# EAGLE design opto-endstop (EAGLE 5.06)
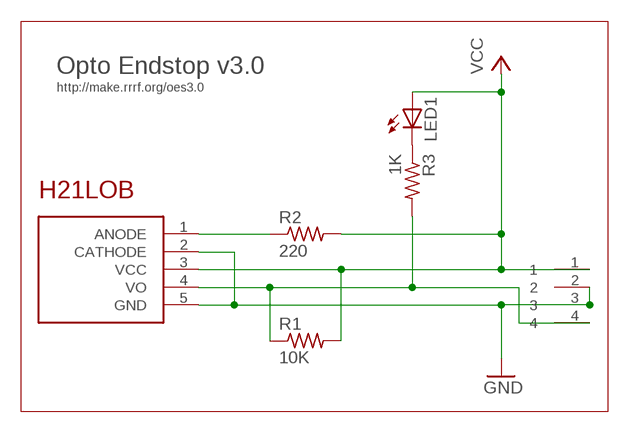
[diagram p0: schematic, sheet 1]

## Parts
LED1  LEDCHIPLED_1206  [CHIPLED_1206]
R1  10K  R-US_R1206  [R1206]
R2  220  R-US_R1206  [R1206]
R3  1K  R-US_R1206  [R1206]
U$1  H21LOB  [H21]
U$2  CDROM  [70553-04]

## Nets
GND: U$1.2(CATHODE) U$1.5(GND) U$2.2 U$2.3
N$1: LED1.C R3.1
N$2: R1.1 R3.2 U$1.4(VO) U$2.4
N$4: R2.1 U$1.1(ANODE)
VCC: LED1.A R1.2 R2.2 U$1.3(VCC) U$2.1

## Notes on the sheet
- Opto Endstop v3.0
- http://make.rrrf.org/oes3.0

## Library data of the parts
LED1 = led:LED: LED OSRAM: - CHIPLED LG R971, LG N971, LY N971, LG Q971, LY Q971, LO R971, LY R971 LH N974, LH R974 LS Q976, LO Q976, LY Q976 LO Q996 - Hyper CHIPLED LW Q18S LB Q993, LB Q99A, LB R99A - SideLED LS A670, LO A670, LY A670, LG A670, LP A670 LB A673, LV A673, LT A673, LW A673 LH A674 LY A675 LS A676, LA A676, LO A676, LY A676, LW A676 LS A679, LY A679, LG A679 - Hyper Micro SIDELED® LS Y876, LA Y876, LO Y876, LY Y876 LT Y87S - SmartLED LW L88C, LW L88S LB L89C, LB L89S, LG L890 LS L89K, LO L89K, LY L89K LS L896, LA L896, LO L896, LY L896 - TOPLED LS T670, LO T670, LY T670, LG T670, LP T670 LSG T670, LSP T670, LSY T670, LOP T670, LYG T670 LG T671, LOG T671, LSG T671 LB T673, LV T673, LT T673, LW T673 LH T674 LS T676, LA T676, LO T676, LY T676, LB T676, LH T676, LSB T676, LW T676 LB T67C, LV T67C, LT T67C, LS T67K, LO T67K, LY T67K, LW E67C LS E67B, LA E67B, LO E67B, LY E67B, LB E67C, LV E67C, LT E67C LW T67C LS T679, LY T679, LG T679 LS T770, LO T770, LY T770, LG T770, LP T770 LB T773, LV T773, LT T773, LW T773 LH T774 LS E675, LA E675, LY E675, LS T675 LS T776, LA T776, LO T776, LY T776, LB T776 LHGB T686 LT T68C, LB T68C - Hyper Mini TOPLED® LB M676 - Mini TOPLED Santana® LG M470 LS M47K, LO M47K, LY M47K Source: http://www.osram.convergy.de - LUMILED® LXK2-PW12-R00, LXK2-PW12-S00, LXK2-PW14-U00, LXK2-PW14-V00 LXK2-PM12-R00, LXK2-PM12-S00, LXK2-PM14-U00 LXK2-PE12-Q00, LXK2-PE12-R00, LXK2-PE12-S00, LXK2-PE14-T00, LXK2-PE14-U00 LXK2-PB12-K00, LXK2-PB12-L00, LXK2-PB12-M00, LXK2-PB14-N00, LXK2-PB14-P00, LXK2-PB14-Q00 LXK2-PR12-L00, LXK2-PR12-M00, LXK2-PR14-Q00, LXK2-PR14-R00 LXK2-PD12-Q00, LXK2-PD12-R00, LXK2-PD12-S00 LXK2-PH12-R00, LXK2-PH12-S00 LXK2-PL12-P00, LXK2-PL12-Q00, LXK2-PL12-R00 Source: www.luxeon.com
R1-R3 = resistor:R-US_: RESISTOR, American symbol
U$1 = reprap:H21LOB
U$2 = reprap:CDROM

## Net classes
0 default: width 0.406 mm, clearance 0.406 mm

## Board
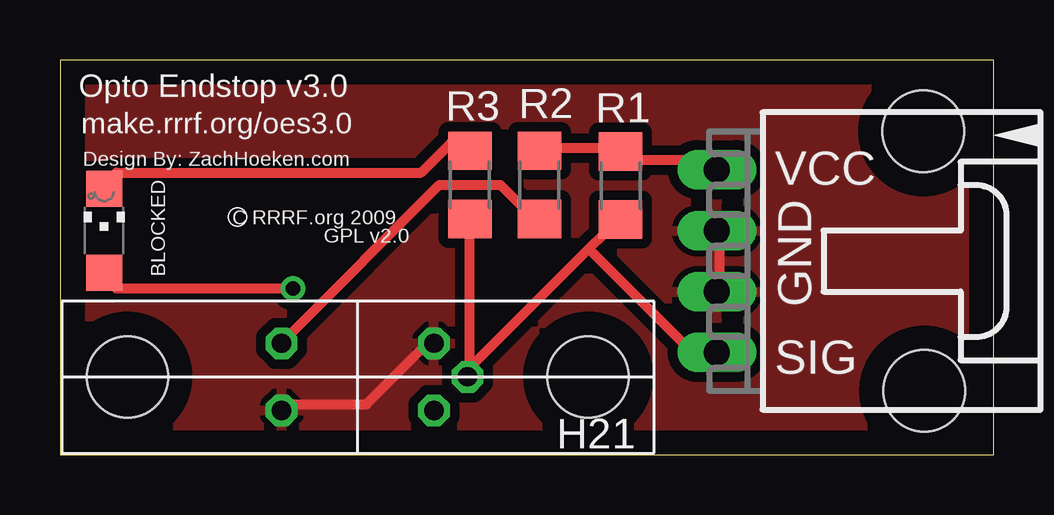
[diagram p1: board, top side]
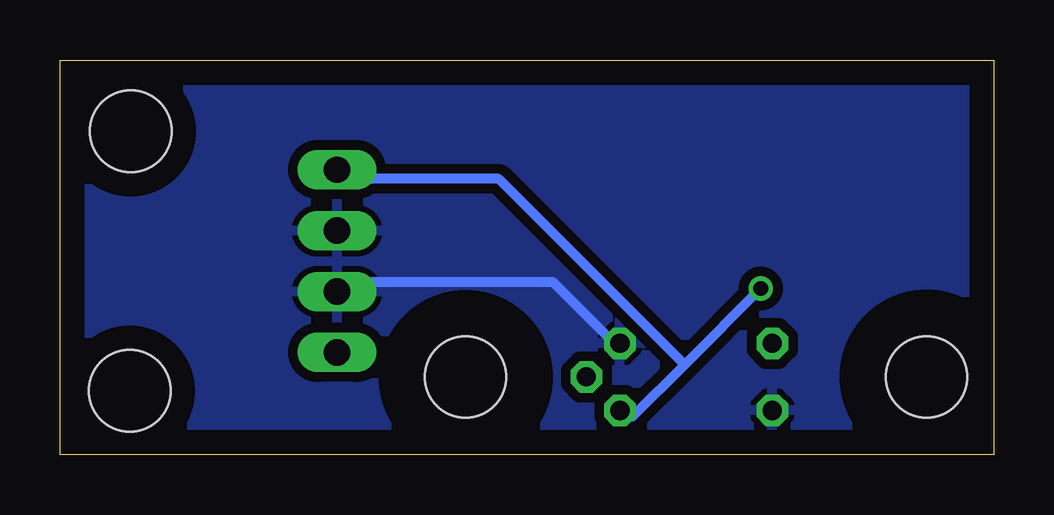
[diagram p2: board, bottom side, seen from below]

Size 38.91 x 16.45 mm. Coordinates in mm from the lower left corner, seen from the top.
Outline: 0,0 38.91,0 38.91,16.45 0,16.45 0,0
Copper layers (1*16): Top 0.035mm / dielectric 1.5mm / Bottom 0.035mm
Design rules "default": minimum track width 10mil, minimum drill 24mil, track to track 8mil, track to pad 8mil, pad to pad 8mil, via to via 8mil, smd to smd 8mil, copper to edge 40mil, drill to drill 8mil, minimum pad ring 10mil, minimum via ring 8mil, stop-mask expansion 4mil, vias tented up to drill 0mil, thermal gap 10mil

### Footprints (pad centres in the part's own frame; a part is rotated, then mirrored left to right if it is on the bottom)
CHIPLED_1206 = smd 1.5 x 1.5: A 0,-1.75; C 0,1.75
R1206 = smd 1.6 x 1.803: 1 -1.422,0; 2 1.422,0
H21 = drill 0.8 octagon: 1 9.169,4.572; 2 9.169,1.778; 3 15.519,1.778; 4 16.916,3.175; 5 15.519,4.572 | hole 3.378: 2.743,3.175; 21.946,3.175
70553-04 = drill 1.092 long: 1 -3.81,-7.62; 2 -1.27,-7.62; 3 1.27,-7.62; 4 3.81,-7.62 | hole 3.4: -5.41,0.98; 5.41,1.02

### Placement (x,y rotation side)
LED1  1.84,9.34 0 top
R1  23.36,11.22 90 top
R2  19.98,11.25 90 top
R3  17.08,11.25 270 top
U$1  0.06,0.07 0 top
U$2  34.99,8.07 270 top

### Tracks (layer width: path | path; a pad name or v marks a point on that pad's centre or on a via)
GND
  Top 0.406: U$2.3 27.5,7.44 27.5,8.71 U$2.2 | U$1.2 9.72,2.1 12.76,2.1 15.05,4.39 U$1.5
  Bottom 0.406: U$2.3 25.97,7.18 18.35,7.18 16.07,4.9 U$1.5
  pour Top: -1.21,17.6 40.7,17.6 40.7,-1.45 -1.21,-1.45
  pour Bottom: -1.21,17.6 40.7,17.6 40.7,-1.45 -1.21,-1.45
N$1
  Top 0.406: LED1.C 2.35,11.76 15.05,11.76 16.32,13.03 R3.1
N$2
  Top 0.406: R3.2 17.08,3.88 U$1.4 17.08,3.63 22.03,8.58 | 22.03,8.58 22.67,9.22 R1.1 | U$2.4 25.97,4.64 22.03,8.58
N$4
  Top 0.406: R2.1 19.11,10.49 18.35,11.25 15.81,11.25 9.46,4.9 U$1.1
VCC  (via drill 0.61)
  Top 0.406: U$2.1 25.97,12.26 24.19,12.26 R1.2 22.67,12.77 20.64,12.77 R2.2 | v9.72,6.93 2.35,6.93 LED1.A
  Bottom 0.406: 12.89,3.75 15.05,1.6 U$1.3 | v9.72,6.93 12.89,3.75 | U$2.1 25.97,11.5 20.64,11.5 12.89,3.75

### Text on the board
tPlace: Opto Endstop v3.0 | make.rrrf.org/oes3.0 | Design By: ZachHoeken.com | VCC | C RRRF.org 2009 | GPL v2.0 | BLOCKED | GND | SIG